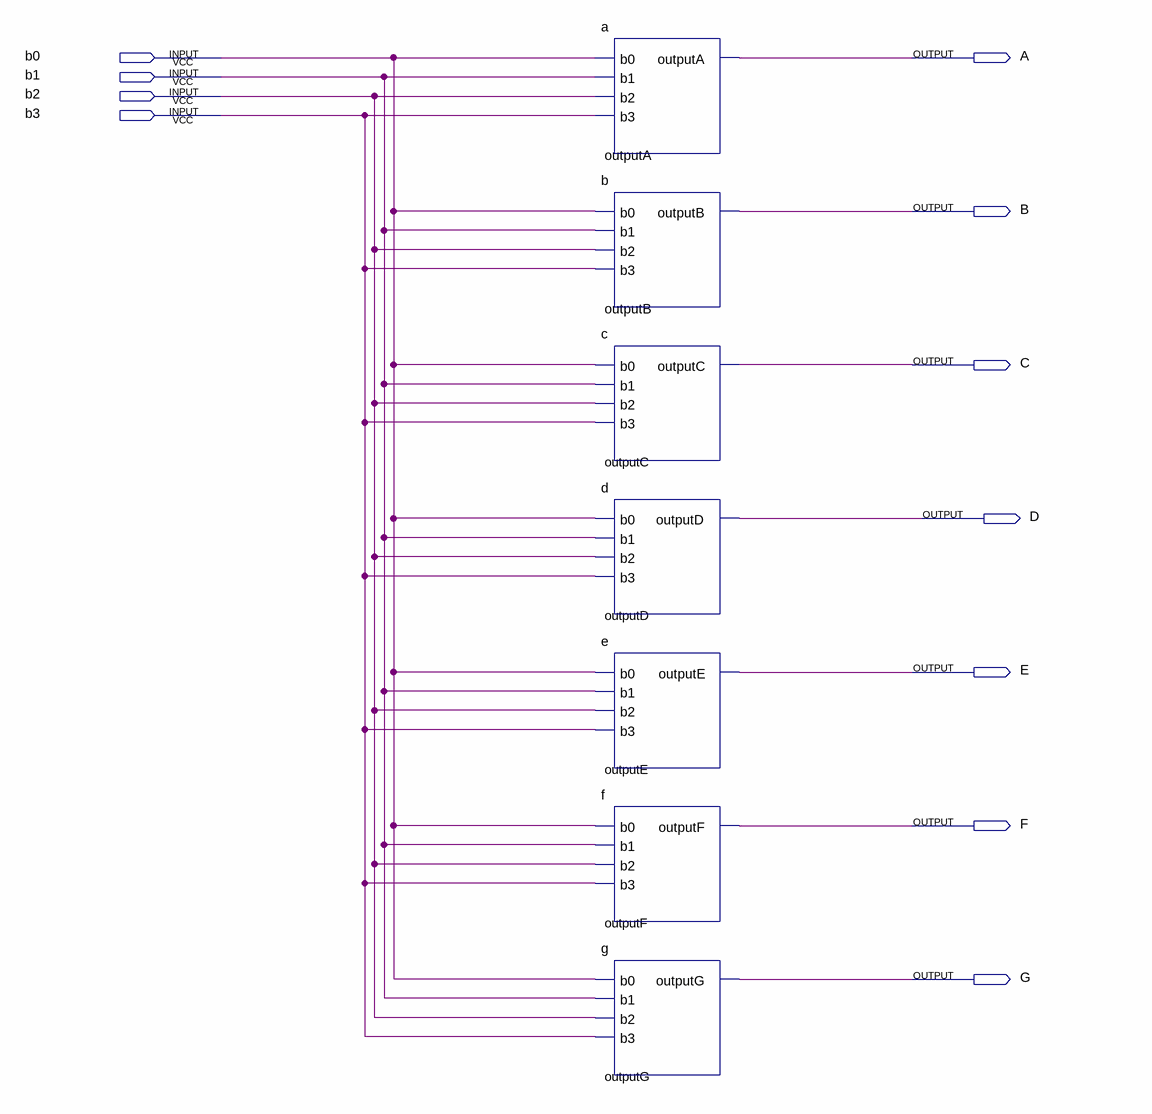
[diagram p0: schematic sheet]
// Quartus schematic Itog.bdf as structural Verilog: 7 symbols, 11 pins
module Itog (
  input  b0,
  input  b1,
  input  b2,
  input  b3,
  output A,
  output B,
  output C,
  output D,
  output E,
  output F,
  output G
);

  a outputA (.b0(b0), .b1(b1), .b2(b2), .b3(b3), .outputA(A));
  b outputB (.b0(b0), .b1(b1), .b2(b2), .b3(b3), .outputB(B));
  c outputC (.b0(b0), .b1(b1), .b2(b2), .b3(b3), .outputC(C));
  d outputD (.b0(b0), .b1(b1), .b2(b2), .b3(b3), .outputD(D));
  e outputE (.b0(b0), .b1(b1), .b2(b2), .b3(b3), .outputE(E));
  f outputF (.b0(b0), .b1(b1), .b2(b2), .b3(b3), .outputF(F));
  g outputG (.b0(b0), .b1(b1), .b2(b2), .b3(b3), .outputG(G));
endmodule
